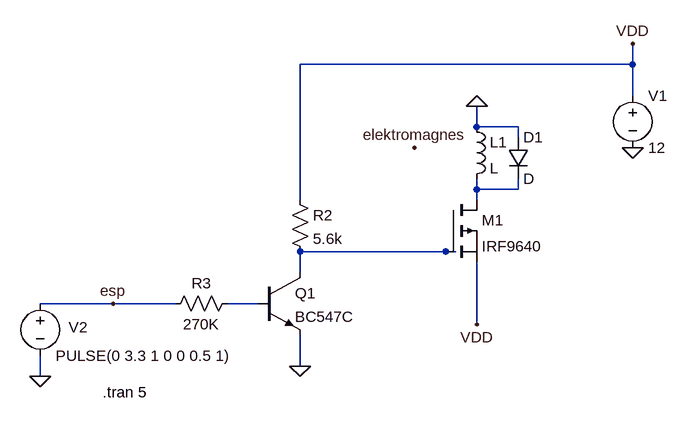
[diagram p0: schematic dropper_simulation.asc]
dropper_simulation.asc, the LTspice schematic file:
Version 4.1
SHEET 1 880 680
WIRE 480 -64 480 -96
WIRE 480 -64 -32 -64
WIRE 480 -16 480 -64
WIRE 240 32 240 0
WIRE 304 32 240 32
WIRE 304 48 304 32
WIRE 240 128 240 112
WIRE 304 128 304 112
WIRE 304 128 240 128
WIRE -32 144 -32 -64
WIRE 240 144 240 128
WIRE 192 224 -32 224
WIRE 208 224 192 224
WIRE -32 256 -32 224
WIRE -320 304 -432 304
WIRE -224 304 -320 304
WIRE -96 304 -144 304
WIRE 240 336 240 240
WIRE -32 400 -32 352
WIRE -432 416 -432 384
FLAG 480 64 0
FLAG -32 400 0
FLAG -432 416 0
FLAG 480 -96 VDD
FLAG 240 336 VDD
FLAG 240 0 0
FLAG -320 304 esp
FLAG 144 64 elektromagnes
DATAFLAG 240 -64 ""
SYMBOL pmos 192 144 R0
SYMATTR InstName M1
SYMATTR Value IRF9640
SYMBOL voltage 480 -32 R0
WINDOW 123 0 0 Left 0
WINDOW 39 0 0 Left 0
SYMATTR InstName V1
SYMATTR Value 12
SYMBOL res -48 128 R0
SYMATTR InstName R2
SYMATTR Value 5.6k
SYMBOL voltage -432 288 R0
WINDOW 0 44 52 Left 2
WINDOW 123 0 0 Left 0
WINDOW 39 0 0 Left 0
SYMATTR InstName V2
SYMATTR Value PULSE(0 3.3 1 0 0 0.5 1)
SYMBOL npn -96 256 R0
SYMATTR InstName Q1
SYMATTR Value BC547C
SYMBOL res -128 288 R90
WINDOW 0 0 56 VBottom 2
WINDOW 3 32 56 VTop 2
SYMATTR InstName R3
SYMATTR Value 270K
SYMBOL ind 224 16 R0
SYMATTR InstName L1
SYMBOL diode 288 48 R0
SYMATTR InstName D1
TEXT -336 440 Left 2 !.tran 5

The netlist it stands for:
* dropper_simulation.asc
M1 N001 N002 VDD VDD IRF9640
V1 VDD 0 12
R2 VDD N002 5.6k
V2 esp 0 PULSE(0 3.3 1 0 0 0.5 1)
Q1 N002 N003 0 0 BC547C
R3 N003 esp 270K
L1 0 N001 L
D1 0 N001 D
.model D D
.lib standard.dio
.model NPN NPN
.model PNP PNP
.lib standard.bjt
.model NMOS NMOS
.model PMOS PMOS
.lib standard.mos
.tran 5
.backanno
.end